# EAGLE schematic SparkFun_TensorFlow_Ambiq_Apollo3 (EAGLE 9.4.2)

## Sheet 1 of 2
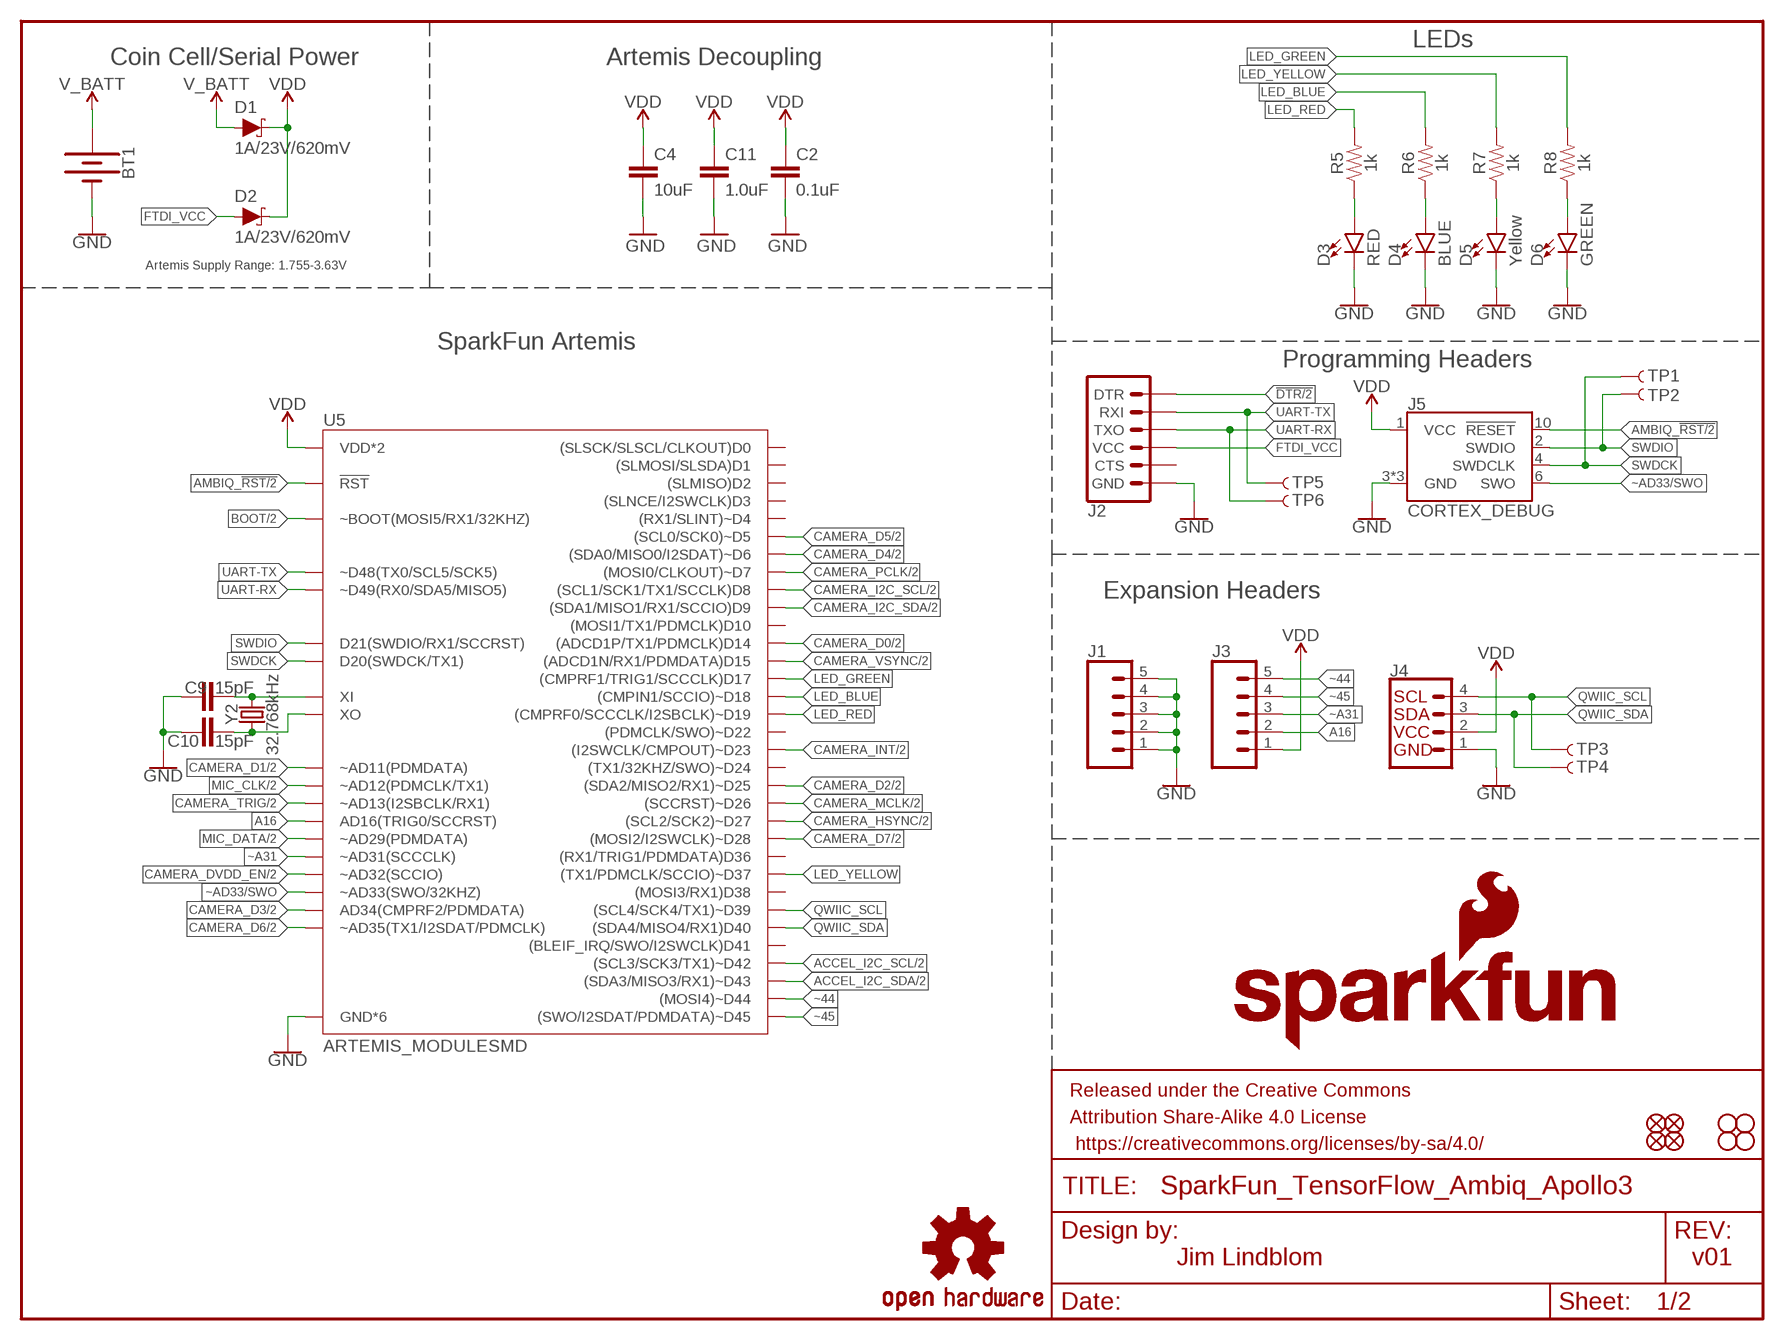
[diagram p0: schematic, sheet 1]

### Parts
BT1  BATTERY-20MM_SMD_4LEGS_OVERPASTE_INNER  [BATTCON_20MM_4LEGS_OVERPASTE_INNER]
C2  0.1uF  0.1UF-0402T-16V-10%  [0402-TIGHT]
C4  10uF  10UF-0603-6.3V-20%  [0603]
C9  15pF  15PF-0402-TIGHT-50V-5%  [0402-TIGHT]
C10  15pF  15PF-0402-TIGHT-50V-5%  [0402-TIGHT]
C11  1.0uF  1.0UF-0402T-16V-10%  [0402-TIGHT]
D1  1A/23V/620mV  DIODE-SCHOTTKY-BAT20J  [SOD-323]
D2  1A/23V/620mV  DIODE-SCHOTTKY-BAT20J  [SOD-323]
D3  RED  LED-RED0603  [LED-0603]
D4  BLUE  LED-BLUE0603  [LED-0603]
D5  Yellow  LED-YELLOW0603  [LED-0603]
D6  GREEN  LED-GREEN0603  [LED-0603]
FD1  FIDUCIAL1X2  [FIDUCIAL-1X2]
FD2  FIDUCIAL1X2  [FIDUCIAL-1X2]
FD3  FIDUCIAL1X2  [FIDUCIAL-1X2]
FD4  FIDUCIAL1X2  [FIDUCIAL-1X2]
FRAME1  FRAME-LETTER  [CREATIVE_COMMONS]
H1  STAND-OFF  [STAND-OFF]
H2  STAND-OFF  [STAND-OFF]
H3  STAND-OFF  [STAND-OFF]
H4  STAND-OFF  [STAND-OFF]
J1  CONN_05NO_SILK  [1X05_NO_SILK]
J2  6_PIN_SERIAL_TARGETSMD  [1X06-SMD_RA_MALE]
J3  CONN_05NO_SILK  [1X05_NO_SILK]
J4  QWIIC_CONNECTORJS-1MM  [JST04_1MM_RA]
J5  CORTEX_DEBUG  CORTEX_DEBUG_MINIMUM_PTH  [2X5-PTH-1.27MM]
LOGO1  SFE_LOGO_NAME_FLAME.1_INCH  [SFE_LOGO_NAME_FLAME_.1]
LOGO2  OSHW-LOGOS  [OSHW-LOGO-S]
R5  1k  1KOHM-0603-1/10W-1%  [0603]
R6  1k  1KOHM-0603-1/10W-1%  [0603]
R7  1k  1KOHM-0603-1/10W-1%  [0603]
R8  1k  1KOHM-0603-1/10W-1%  [0603]
TP1  TEST-POINT3X5  [PAD.03X.05]
TP2  TEST-POINT3X5  [PAD.03X.05]
TP3  TEST-POINT3X5  [PAD.03X.05]
TP4  TEST-POINT3X5  [PAD.03X.05]
TP5  TEST-POINT3X5  [PAD.03X.05]
TP6  TEST-POINT3X5  [PAD.03X.05]
U5  ARTEMIS_MODULESMD  [ARTEMIS_FP]
Y2  32.768kHz  CRYSTAL-32.768KHZSMD-3.2X1.5  [CRYSTAL-SMD-3.2X1.5MM]

### Nets
!DTR: J2.1(DTR) ; also sheet 2
A16: J3.2 U5.AD16(AD16(TRIG0/SCCRST))
ACCEL_I2C_SCL: U5.~D42((SCL3/SCK3/TX1)~D42) ; also sheet 2
ACCEL_I2C_SDA: U5.~D43((SDA3/MISO3/RX1)~D43) ; also sheet 2
AMBIQ_!RST: J5.10(!RESET) U5.~RST(!RST) ; also sheet 2
BOOT: U5.BOOT(~BOOT(MOSI5/RX1/32KHZ)) ; also sheet 2
CAMERA_D0: U5.D14((ADCD1P/TX1/PDMCLK)D14) ; also sheet 2
CAMERA_D1: U5.~AD11(~AD11(PDMDATA)) ; also sheet 2
CAMERA_D2: U5.~D25((SDA2/MISO2/RX1)~D25) ; also sheet 2
CAMERA_D3: U5.AD34(AD34(CMPRF2/PDMDATA)) ; also sheet 2
CAMERA_D4: U5.~D6((SDA0/MISO0/I2SDAT)~D6) ; also sheet 2
CAMERA_D5: U5.~D5((SCL0/SCK0)~D5) ; also sheet 2
CAMERA_D6: U5.~AD35(~AD35(TX1/I2SDAT/PDMCLK)) ; also sheet 2
CAMERA_D7: U5.~D28((MOSI2/I2SWCLK)~D28) ; also sheet 2
CAMERA_DVDD_EN: U5.~AD32(~AD32(SCCIO)) ; also sheet 2
CAMERA_HSYNC: U5.~D27((SCL2/SCK2)~D27) ; also sheet 2
CAMERA_I2C_SCL: U5.D8((SCL1/SCK1/TX1/SCCLK)D8) ; also sheet 2
CAMERA_I2C_SDA: U5.D9((SDA1/MISO1/RX1/SCCIO)D9) ; also sheet 2
CAMERA_INT: U5.~D23((I2SWCLK/CMPOUT)~D23) ; also sheet 2
CAMERA_MCLK: U5.~D26((SCCRST)~D26) ; also sheet 2
CAMERA_PCLK: U5.D7((MOSI0/CLKOUT)~D7) ; also sheet 2
CAMERA_TRIG: U5.~AD13(~AD13(I2SBCLK/RX1)) ; also sheet 2
CAMERA_VSYNC: U5.D15((ADCD1N/RX1/PDMDATA)D15) ; also sheet 2
FTDI_VCC: D2.A J2.4(VCC)
GND: BT1.2(-) C2.1 C4.2 C9.1 C10.1 C11.2 D3.C D4.C D5.C D6.C J1.1 J1.2 J1.3 J1.4 J1.5 J2.6(GND) J4.1 J5.3(GND) J5.5(GND) J5.9(GND) U5.GND@1(GND*6) U5.GND@22(GND*6) U5.GND@38(GND*6) U5.GND@39(GND*6) U5.GND@47(GND*6) U5.GND@59(GND*6) ; also sheet 2
LED_BLUE: R6.2 U5.~D18((CMPIN1/SCCIO)~D18)
LED_GREEN: R8.2 U5.D17((CMPRF1/TRIG1/SCCCLK)D17)
LED_RED: R5.2 U5.~D19((CMPRF0/SCCCLK/I2SBCLK)~D19)
LED_YELLOW: R7.2 U5.~D37((TX1/PDMCLK/SCCIO)~D37)
MIC_CLK: U5.~AD12(~AD12(PDMCLK/TX1)) ; also sheet 2
MIC_DATA: U5.~AD29(~AD29(PDMDATA)) ; also sheet 2
N$2: C9.2 U5.XI Y2.P$2
N$5: D4.A R6.1
N$6: D3.A R5.1
N$7: D5.A R7.1
N$8: D6.A R8.1
QWIIC_SCL: J4.4 TP3.P$1 U5.~D39((SCL4/SCK4/TX1)~D39)
QWIIC_SDA: J4.3 TP4.P$1 U5.D40((SDA4/MISO4/RX1)D40)
SWDCK: J5.4(SWDCLK) TP1.P$1 U5.SWDCK(D20(SWDCK/TX1))
SWDIO: J5.2(SWDIO) TP2.P$1 U5.SWDIO(D21(SWDIO/RX1/SCCRST))
UART-RX: J2.3(TXO) TP6.P$1 U5.RXI-0(~D49(RX0/SDA5/MISO5))
UART-TX: J2.2(RXI) TP5.P$1 U5.TXO-0(~D48(TX0/SCL5/SCK5))
V_BATT: BT1.1(+) D1.A
VDD: C2.2 C4.1 C11.1 D1.C D2.C J3.1 J4.2 J5.1(VCC) U5.VDD@36(VDD*2) U5.VDD@37(VDD*2) ; also sheet 2
X0: C10.2 U5.XO Y2.P$1
~44: J3.5 U5.~D44((MOSI4)~D44)
~45: J3.4 U5.~D45((SWO/I2SDAT/PDMDATA)~D45)
~A31: J3.3 U5.~AD31(~AD31(SCCCLK))
~AD33/SWO: J5.6(SWO) U5.~AD33/SWO(~AD33(SWO/32KHZ))
Unconnected: J2.5(CTS) U5.D0((SLSCK/SLSCL/CLKOUT)D0) U5.D1((SLMOSI/SLSDA)D1) U5.D2((SLMISO)D2) U5.D3((SLNCE/I2SWCLK)D3) U5.D10((MOSI1/TX1/PDMCLK)D10) U5.D36((RX1/TRIG1/PDMDATA)D36) U5.D38((MOSI3/RX1)D38) U5.D41((BLEIF_IRQ/SWO/I2SWCLK)D41) U5.~D4((RX1/SLINT)~D4) U5.~D22((PDMCLK/SWO)~D22) U5.~D24((TX1/32KHZ/SWO)~D24)

### Notes on the sheet
- LEDs
- Coin Cell/Serial Power | Artemis Decoupling
- Artemis Supply Range: 1.755-3.63V
- SparkFun Artemis
- Programming Headers
- Expansion Headers
- Jim Lindblom | v01

## Sheet 2 of 2
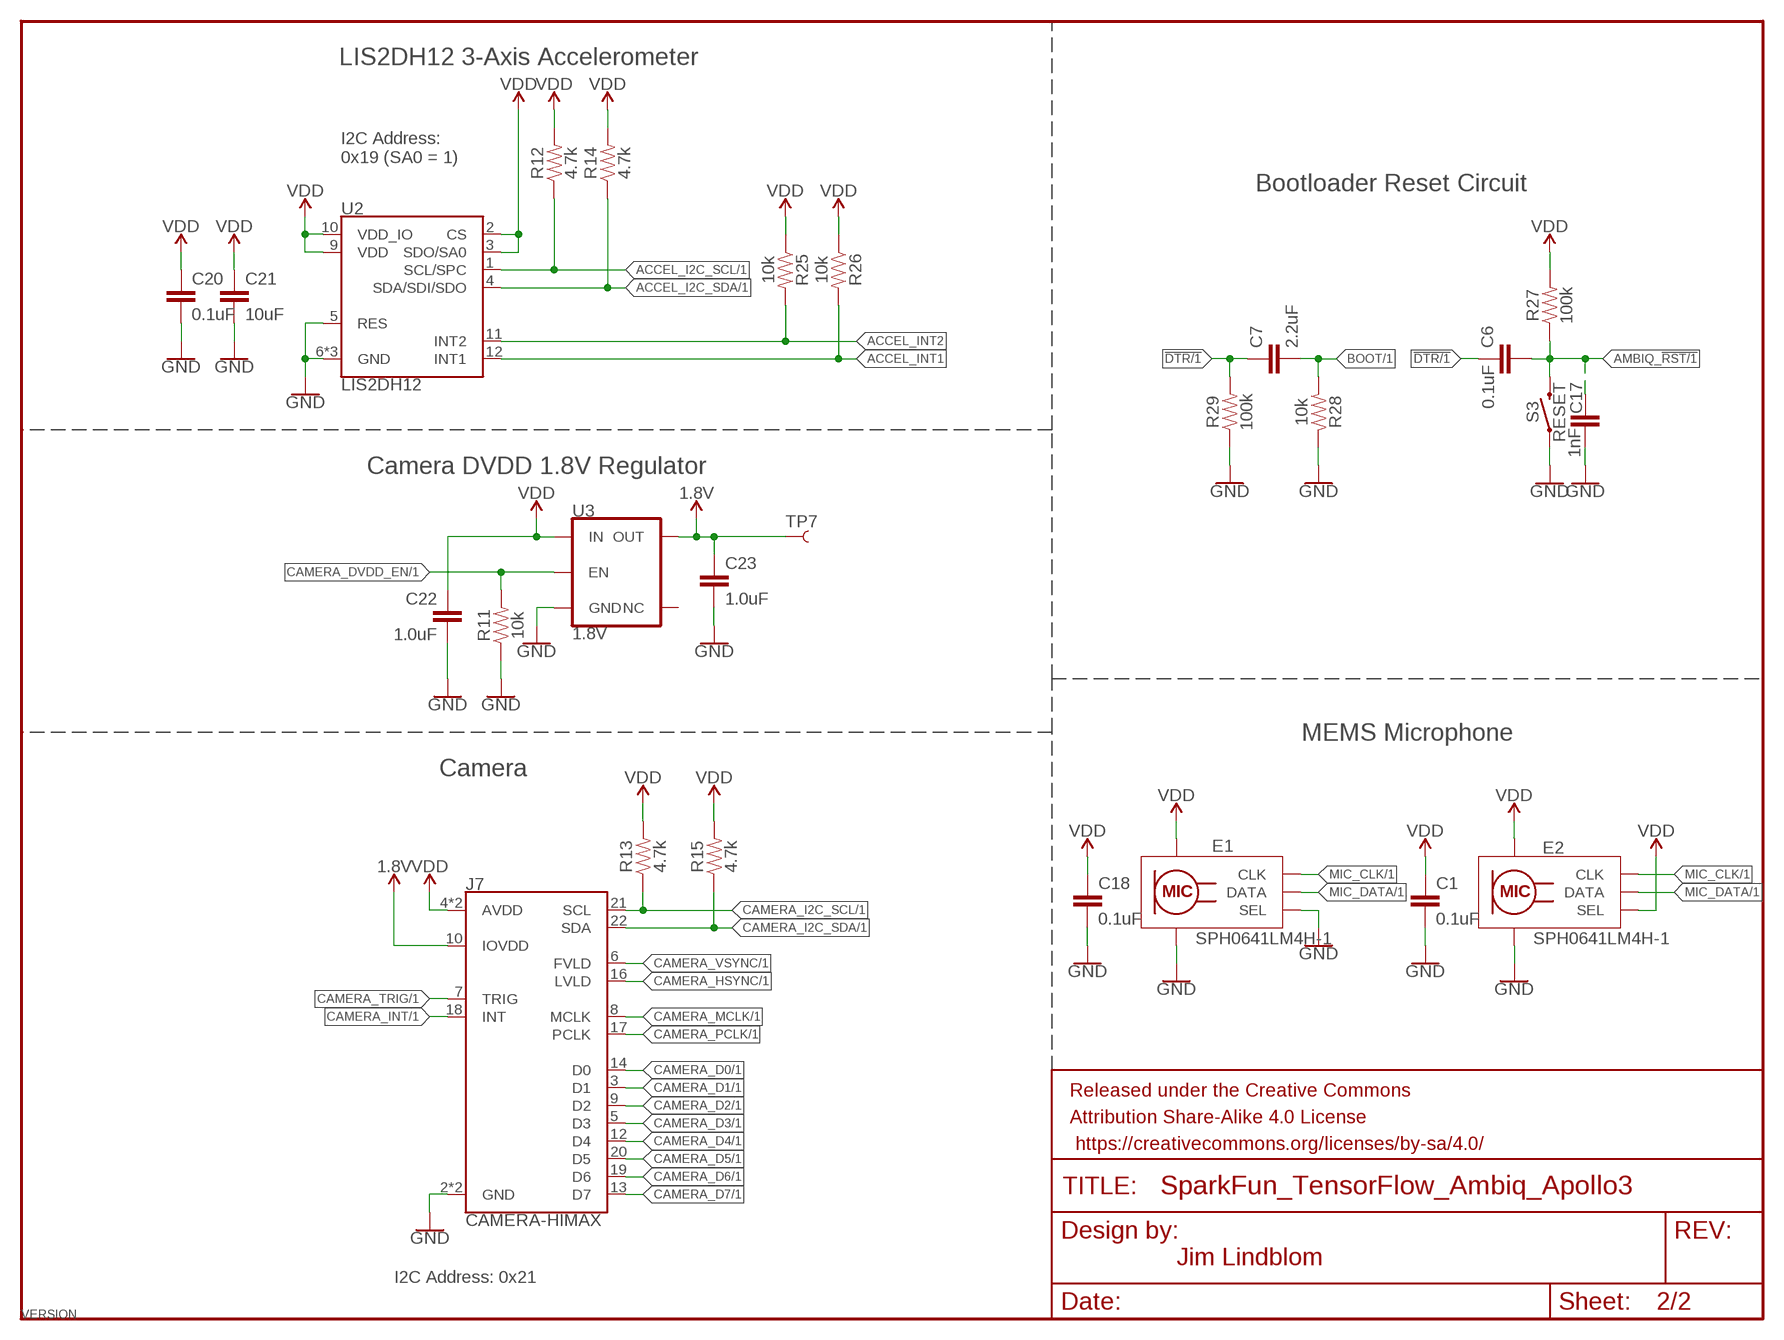
[diagram p1: schematic, sheet 2]

### Parts
C1  0.1uF  0.1UF-0402-TIGHT-16V-10%  [0402-TIGHT]
C6  0.1uF  0.1UF-0603-25V-5%  [0603]
C7  2.2uF  2.2UF-0603-10V-20%  [0603]
C17  1nF  1.0NF/1000PF-0603-50V-10%  [0603]
C18  0.1uF  0.1UF-0402-TIGHT-16V-10%  [0402-TIGHT]
C20  0.1uF  0.1UF-0402-TIGHT-16V-10%  [0402-TIGHT]
C21  10uF  10UF-0603-6.3V-20%  [0603]
C22  1.0uF  1.0UF-0402-TIGHT-16V-10%  [0402-TIGHT]
C23  1.0uF  1.0UF-0402-TIGHT-16V-10%  [0402-TIGHT]
E1  SPH0641LM4H-1  SPH0641LM4H-1_MICROPHONE  [SPH0641LM4H-1_MICROPHONE]
E2  SPH0641LM4H-1  SPH0641LM4H-1_MICROPHONE  [SPH0641LM4H-1_MICROPHONE]
FRAME2  FRAME-LETTERNO_PACKAGE  [DUMMY]
J7  CAMERA-HIMAX  [FPC-24-AMPHENOL-SFV24R-1STE1HLF]
R11  10k  10KOHM-0402T-1/16W-1%  [0402-TIGHT]
R12  4.7k  4.7KOHM-0603-1/10W-1%  [0603]
R13  4.7k  4.7KOHM-0603-1/10W-1%  [0603]
R14  4.7k  4.7KOHM-0603-1/10W-1%  [0603]
R15  4.7k  4.7KOHM-0603-1/10W-1%  [0603]
R25  10k  10KOHM-0402T-1/16W-1%  [0402-TIGHT]
R26  10k  10KOHM-0402T-1/16W-1%  [0402-TIGHT]
R27  100k  100KOHM-0603-1/10W-1%  [0603]
R28  10k  10KOHM-0603-1/10W-1%  [0603]
R29  100k  100KOHM-0603-1/10W-1%  [0603]
S3  RESET  MOMENTARY-SWITCH-SPST-SMD-4.6X2.8MM  [TACTILE_SWITCH_SMD_4.6X2.8MM]
TP7  TEST-POINT3X5  [PAD.03X.05]
U2  LIS2DH12  [LGA-12-LISDH12]
U3  1.8V  V_REG_AP2127K-1.8V  [SOT23-5]

### Nets
1.8V: C23.1 J7.10(IOVDD) TP7.P$1 U3.5(OUT)
!DTR: C6.1 C7.1 R29.2 ; also sheet 1
ACCEL_I2C_SCL: R12.1 U2.1(SCL/SPC) ; also sheet 1
ACCEL_I2C_SDA: R14.1 U2.4(SDA/SDI/SDO) ; also sheet 1
ACCEL_INT1: R26.2 U2.12(INT1)
ACCEL_INT2: R25.2 U2.11(INT2)
AMBIQ_!RST: C6.2 C17.1 R27.1 S3.3 S3.4 ; also sheet 1
BOOT: C7.2 R28.2 ; also sheet 1
CAMERA_D0: J7.14(D0) ; also sheet 1
CAMERA_D1: J7.3(D1) ; also sheet 1
CAMERA_D2: J7.9(D2) ; also sheet 1
CAMERA_D3: J7.5(D3) ; also sheet 1
CAMERA_D4: J7.12(D4) ; also sheet 1
CAMERA_D5: J7.20(D5) ; also sheet 1
CAMERA_D6: J7.19(D6) ; also sheet 1
CAMERA_D7: J7.13(D7) ; also sheet 1
CAMERA_DVDD_EN: R11.2 U3.3(EN) ; also sheet 1
CAMERA_HSYNC: J7.16(LVLD) ; also sheet 1
CAMERA_I2C_SCL: J7.21(SCL) R13.1 ; also sheet 1
CAMERA_I2C_SDA: J7.22(SDA) R15.1 ; also sheet 1
CAMERA_INT: J7.18(INT) ; also sheet 1
CAMERA_MCLK: J7.8(MCLK) ; also sheet 1
CAMERA_PCLK: J7.17(PCLK) ; also sheet 1
CAMERA_TRIG: J7.7(TRIG) ; also sheet 1
CAMERA_VSYNC: J7.6(FVLD) ; also sheet 1
GND: C1.2 C17.2 C18.2 C20.2 C21.2 C22.2 C23.2 E1.2(SEL) E1.3(GND) E1.6(GND) E1.7(GND) E1.8(GND) E2.3(GND) E2.6(GND) E2.7(GND) E2.8(GND) J7.2(GND) J7.15(GND) R11.1 R28.1 R29.1 S3.1 S3.2 U2.5(RES) U2.6(GND) U2.7(GND) U2.8(GND) U3.2(GND) ; also sheet 1
MIC_CLK: E1.4(CLK) E2.4(CLK) ; also sheet 1
MIC_DATA: E1.1(DATA) E2.1(DATA) ; also sheet 1
VDD: C1.1 C18.1 C20.1 C21.1 C22.1 E1.5(VDD) E2.2(SEL) E2.5(VDD) J7.4(AVDD) J7.11(AVDD) R12.2 R13.2 R14.2 R15.2 R25.1 R26.1 R27.2 U2.2(CS) U2.3(SDO/SA0) U2.9(VDD) U2.10(VDD_IO) U3.1(IN) ; also sheet 1
Unconnected: J7.MNT1@0(MNT1) J7.MNT1@1(MNT1) J7.MNT2@0(MNT2) J7.MNT2@1(MNT2) U3.4(NC)

### Notes on the sheet
- LIS2DH12 3-Axis Accelerometer
- I2C Address:
  0x19 (SA0 = 1)
- Bootloader Reset Circuit
- Camera DVDD 1.8V Regulator
- MEMS Microphone
- Camera
- Jim Lindblom
- I2C Address: 0x21

## Library data of the parts
BT1 = SparkFun-Batteries:BATTERY: Battery - Single Cell A variety of battery chemistries, sizes, and footprints. Device List: 20MM_PTH - Coin Cell Battery Holder - 20mm (PTH) <https://www.sparkfun.com/products/783> 20MM_PTH_KIT- Coin Cell battery Holder - 20 mm (PTH) <http://www.sparkfun.com/products/783>kit version with special mask 6.8MM_PTH - Coin Cell Battery Holder - 6.8MM(SMD) <https://www.digikey.com/product-detail/en/seiko-instruments/MS621FE-FL11E/728-1057-ND/1889208?WT.srch=1&gclid=CNOQ5a6LzdQCFZS2wAodXCkE0g> 12MM_SMD - Coin Cell Battery Holder - 12mm (SMD) <https://www.sparkfun.com/products/10592> 12MM_PTH - Coin Cell Battery Holder - 12mm (PTH) <https://www.sparkfun.com/products/7948> 20MM_SMD - 20mm Coin Cell Battery Holder (SMD) (2 legs) Used on the Big Time Watch Kit <https://www.sparkfun.com/products/11734> 20MM_SMD_4LEGS - Coin Cell Battery Holder - 20mm (SMD) <https://www.sparkfun.com/products/11892> 20MM_SMD_4LEGS_OVERPASTE - Coin Cell Battery Holder - 20mm (SMD) <https://www.sparkfun.com/products/11892> (Over-paste on the legs) 24.5MM_PTH - Coin Cell Battery Holder - 24.5mm (PTH) <https://www.sparkfun.com/products/8863> 9V - 9V Battery Holder - PC Mount Used on the SparkFun SparkPunk Sound Kit <https://www.sparkfun.com/products/11177> and SparkFun SparkPunk Sequencer Kit <https://www.sparkfun.com/products/12707> 18650 - Battery Holder - 18650 (PTH) <https://www.sparkfun.com/products/13113> AA - Battery Holder - 1xAA (PTH) <https://www.sparkfun.com/products/7949> AAA - Battery Holder - 1xAAA (PTH) <https://www.sparkfun.com/products/12718> AA_KIT - Battery Holder - 1xAA (PTH) <https://www.sparkfun.com/products/7949> Special kit package - pads only have exposed copper on one side of the board. AAA_KIT - Battery Holder - 1xAAA (PTH) <https://www.sparkfun.com/products/12718> Special kit package - pads only have exposed copper on one side of the board.
C1 C18 C20 = ambiq:0.1UF: 0.1µF ceramic capacitors A capacitor is a passive two-terminal electrical component used to store electrical energy temporarily in an electric field.; PROD_ID: CAP-12416
C2 = SparkFun-Capacitors:0.1UF: 0.1µF ceramic capacitors A capacitor is a passive two-terminal electrical component used to store electrical energy temporarily in an electric field.; PROD_ID: CAP-12416
C4 C21 = SparkFun-Capacitors:10UF: 10.0µF ceramic capacitors A capacitor is a passive two-terminal electrical component used to store electrical energy temporarily in an electric field.; PROD_ID: CAP-11015
C6 = SparkFun-Capacitors:0.1UF: 0.1µF ceramic capacitors A capacitor is a passive two-terminal electrical component used to store electrical energy temporarily in an electric field.; PROD_ID: CAP-08604
C7 = SparkFun-Capacitors:2.2UF: 2.2µF ceramic capacitors A capacitor is a passive two-terminal electrical component used to store electrical energy temporarily in an electric field.; PROD_ID: CAP-07888
C9 C10 = ambiq:15PF: 15pF ceramic capacitors A capacitor is a passive two-terminal electrical component used to store electrical energy temporarily in an electric field.; PROD_ID: CAP-13063
C11 = SparkFun-Capacitors:1.0UF: 1µF ceramic capacitors A capacitor is a passive two-terminal electrical component used to store electrical energy temporarily in an electric field.; PROD_ID: CAP-12417
C17 = SparkFun-Capacitors:1.0NF/1000PF: 1nF/1,000pF ceramic capacitors A capacitor is a passive two-terminal electrical component used to store electrical energy temporarily in an electric field.; PROD_ID: CAP-07886
C22 C23 = ambiq:1.0UF: 1µF ceramic capacitors A capacitor is a passive two-terminal electrical component used to store electrical energy temporarily in an electric field.; PROD_ID: CAP-12417
D1 D2 = SparkFun-DiscreteSemi:DIODE-SCHOTTKY: Schottky diode A Schottky diode is a semiconductor diode which has a low forward voltage drop and a very fast switching action.; PROD_ID: DIO-11623
D3 = SparkFun-LED:LED-RED: Red SMD LED Used in manufacturing of most products at SparkFun Packages: 0603 - SMD 0603 package [Product Link] <http://docs.avagotech.com/docs/AV02-0551EN> 0603 SMART - SMD 0603 SMART package ( more efficient and expensive)[Product Link] <http://www.osram-os.com/Graphics/XPic2/00077099_0.pdf> 1206 - SMD1206 package [Product Link] <https://www.sparkfun.com/datasheets/DevTools/LilyPad/Q150OVS4.pdff> SparkFun Products: Pro Mini 328 -5V <https://www.sparkfun.com/products/821> RedBoard <https://www.sparkfun.com/products/12757> IOIO-OTG <https://www.sparkfun.com/products/13613>; PROD_ID: DIO-00819
D4 = SparkFun-LED:LED-BLUE: Blue SMD LED Used in manufacturing of various products at SparkFun Packages: 0603 - SMD 0603 package [Product Link] <http://www.digikey.com/product-detail/en/SMLE12BC7TT86/511-1589-2-ND/1641808> 1206 - SMD1206 package [Product Link] <http://www.digikey.com/product-detail/en/lite-on-inc/LTST-C150TBKT/160-1643-1-ND/573584> SparkFun Products: ESP8266 Thing-Dev Board <https://www.sparkfun.com/products/13711> RedBoard <https://www.sparkfun.com/products/12757>; PROD_ID: DIO-08575
D5 = SparkFun-LED:LED-YELLOW: Yellow SMD LED Used in manufacturing several products at SparkFun. Packages: 0603 - SMD 0603 package[Product Link] <http://www.kingbrightusa.com/product.asp?catalog_name=LED&product_id=APT1608SYCK> 0603 -SMART - SMART SMD 0603 package (more efficient/more expensive) [Product Link] <http://www.osram-os.com/osram_os/en/products/product-catalog/led-light-emitting-diodes/smartled-0603/ly-l29k/index.jsp> LilyPad - SMD1206 package[Product Datasheet] <https://www.sparkfun.com/datasheets/DevTools/LilyPad/Q150YUS4.pdf> SparkFun Products: Blynk Board <https://www.sparkfun.com/products/13794> IOIO-OTG <https://www.sparkfun.com/products/13613> XBee Explorer Serial <https://www.sparkfun.com/products/13225>; PROD_ID: DIO-09003
D6 = SparkFun-LED:LED-GREEN: Green SMD LED Used in manufacturing of various products at SparkFun Packages: 0603 - SMD 0603 package [Product Link] <http://www.futureelectronics.com/en/technologies/semiconductors/optoelectronics/leds/Pages/9894312-LTST-C190GKT.aspx?CrossPart=HSMG-C190&IM=0> LilyPad 1206 - SMD1206 LilyPad package [Product Link] <http://www.futureelectronics.com/en/Technologies/Product.aspx?ProductID=IN150NGHARVATEKCORPORATION2049943&IM=0> 1206 - SMD1206 package [Product Link] <http://www.futureelectronics.com/en/technologies/semiconductors/optoelectronics/leds/Pages/8315665-LTST-C150KGKT.aspx?IM=0> 1206 Bottom Mount -SMD 1206 Bottom Mount [Product Link] <http://www.digikey.com/product-detail/en/lite-on-inc/LTST-C230KGKT/160-1456-1-ND/386854> SparkFun Products: Pro Mini 328 -5V <https://www.sparkfun.com/products/821> RedBoard <https://www.sparkfun.com/products/12757> MP3 Trigger <https://www.sparkfun.com/products/13720> Makey Makey <https://www.sparkfun.com/products/11076>; PROD_ID: DIO-00821
E1 E2 = SparkFun-Sensors:SPH0641LM4H-1_MICROPHONE: SPH0641LM4H-1 Microphone A miniature, high-performance, low power, bottom port silicon digital microphone with a single bit PDM output.; PROD_ID: IC-14361
FD1-FD4 = SparkFun-Aesthetics:FIDUCIAL: Fiducial Alignment Points Point-of-reference for pick-and-place machines and other optical instruments.
FRAME1 = SparkFun-Aesthetics:FRAME-LETTER: Schematic Frame - Letter Standard 8.5x11 US Letter frame
FRAME2 = SparkFun-Aesthetics:FRAME-LETTER: Schematic Frame - Letter Standard 8.5x11 US Letter frame; DESIGNER: Nobody; VERSION: x01
H1-H4 = SparkFun-Hardware:STAND-OFF: Stand Off Drill holes for mechanically mounting via screws, standoffs, etc. Note: Use the keepout ring to avoid running the screw head into surrounding components. Variant Overviews STAND-OFF - Mechanical footprint for a #4 phillips button head screw. STAND-OFF-TIGHT - Mechanical footprint for a #4 phillips button head screw, Example SparkFun Products Screw - Phillips Head (1/4", 4-40, 10 pack) <https://www.sparkfun.com/products/10453> (PRT-10453) Screw - Phillips Head (1/2", 4-40, 10 pack) <https://www.sparkfun.com/products/10452> (PRT-10452) Screw - Phillips Head (3/4", 4-40, 10 pack) <https://www.sparkfun.com/products/10451> (PRT-10451) Screw - Phillips Head (1", 4-40, 10 pack) <https://www.sparkfun.com/products/10450> (PRT-10450)
J1 J3 = SparkFun-Connectors:CONN_05: Multi connection point. Often used as Generic Header-pin footprint for 0.1 inch spaced/style header connections On any of the 0.1 inch spaced packages, you can populate with these: Break Away Headers - Straight <https://www.sparkfun.com/products/116> (PRT-00116) Break Away Male Headers - Right Angle <https://www.sparkfun.com/products/553> (PRT-00553) Female Headers <https://www.sparkfun.com/products/115> (PRT-00115) Break Away Headers - Machine Pin <https://www.sparkfun.com/products/117> (PRT-00117) Break Away Female Headers - Swiss Machine Pin <https://www.sparkfun.com/products/743> (PRT-00743) For SCREWTERMINALS and SPRING TERMINALS visit here: Screw Terimnals on SparkFun.com <https://www.sparkfun.com/search/results?term=Screw+Terminals> (5mm/3.5mm/2.54mm spacing) This device is also useful as a general connection point to wire up your design to another part of your project. Our various solder wires solder well into these plated through hole pads. Hook-Up Wire - Assortment (Stranded, 22 AWG) <https://www.sparkfun.com/products/11375> (PRT-11375) Hook-Up Wire - Assortment (Solid Core, 22 AWG) <https://www.sparkfun.com/products/11367> (PRT-11367) View the entire wire category on our website here <https://www.sparkfun.com/categories/141> Special notes: Molex polarized connector foot print use with SKU : PRT-08231 with associated crimp pins and housings. 1MM SMD Version SKU: PRT-10208
J2 = SparkFun-Connectors:6_PIN_SERIAL_TARGET: 6-pin header connection for use with the "FTDI BASIC" pinout - TARGET SIDE. Also known as "Arduino Serial Program Header". It is used to mate with our FTDI Basic serial programmers using the Arduino IDE. Note, this device has "TARGET" in the name. It is intended to be used on a design that contains a target micro-controller that you wish to program. The "sister" device, named "CABLE" is inteneded to be used on a design that usually lives on the end of your USB cable and prvides the converter chip (FTDI232 or FTDI231x) to commnicate serial RX/TX. You can populate with some of these: Break Away Headers - Straight <https://www.sparkfun.com/products/116> (PRT-00116) For reference (or to suit your programming needs) check out these designs: SparkFun FTDI Basic Breakout - 5V <https://www.sparkfun.com/products/9716> (DEV-09716) SparkFun FTDI Basic Breakout - 3.3V <https://www.sparkfun.com/products/9873> (DEV-09873) SparkFun FTDI SmartBasic <https://www.sparkfun.com/products/12935> (DEV-12935) SparkFun Beefy 3 - FTDI Basic Breakout <https://www.sparkfun.com/products/13746> (DEV-13746); PROD_ID: CONN-08971
J4 = SparkFun-Connectors:QWIIC_CONNECTOR: SparkFun I2C Standard Qwiic Connector An SMD 1mm pitch JST connector makes it easy and quick (get it? Qwiic?) to connect I2C devices to each other. The Qwiic system <http://www.sparkfun.com/qwiic> enables fast and solderless connection between popular platforms and various sensors and actuators. We carry 200mm <https://www.sparkfun.com/products/14204>, 100mm <https://www.sparkfun.com/products/14205>, 50mm <https://www.sparkfun.com/products/14206>, and breadboard friendly <https://www.sparkfun.com/products/14207> Qwiic cables. We also offer 10 pcs strips <https://www.sparkfun.com/products/14323> the SMD connectors.; PROD_ID: CONN-13694
J5 = SparkFun-Connectors:CORTEX_DEBUG_MINIMUM: Cortex Debug Connector - 10 pin Supports JTAG debug, Serial Wire debug, and Serial Wire Viewer. PTH and SMD connector options available. General Connector Information <http://infocenter.arm.com/help/topic/com.arm.doc.faqs/attached/13634/cortex_debug_connectors.pdf> Products: PTH Connector <http://www.digikey.com/product-detail/en/cnc-tech/3220-10-0100-00/1175-1627-ND/3883661> -via Digi-Key SparkFun PSoc <https://www.sparkfun.com/products/13229> SparkFun T <https://www.sparkfun.com/products/13810>
J7 = SparkFun-Connectors:CAMERA-HIMAX; DIGIKEY: 609-4320-2-ND; PROD_ID: CONN-14233
LOGO1 = SparkFun-Aesthetics:SFE_LOGO_NAME_FLAME: SparkFun Font Logo w/ Flame This is the SparkFun full logo. The logo on the schematic will always be the same size; the package variant is the height of the flame part of the logo. Default layer for the logo on the board is tSilk.
LOGO2 = SparkFun-Aesthetics:OSHW-LOGO: Open-Source Hardware (OSHW) Logo This logo indicates the piece of hardware it is found on incorporates a OSHW license and/or adheres to the definition of open source hardware found here: http://freedomdefined.org/OSHW
R5-R8 = SparkFun-Resistors:1KOHM: 1kΩ resistor A resistor is a passive two-terminal electrical component that implements electrical resistance as a circuit element. Resistors act to reduce current flow, and, at the same time, act to lower voltage levels within circuits. - Wikipedia; PROD_ID: RES-07856
R11 R25 R26 = SparkFun-Resistors:10KOHM: 10kΩ resistor A resistor is a passive two-terminal electrical component that implements electrical resistance as a circuit element. Resistors act to reduce current flow, and, at the same time, act to lower voltage levels within circuits. - Wikipedia; PROD_ID: RES-14241
R12-R15 = SparkFun-Resistors:4.7KOHM: 4.7kΩ resistor A resistor is a passive two-terminal electrical component that implements electrical resistance as a circuit element. Resistors act to reduce current flow, and, at the same time, act to lower voltage levels within circuits. - Wikipedia; PROD_ID: RES-07857
R27 R29 = SparkFun-Resistors:100KOHM: 100kΩ resistor A resistor is a passive two-terminal electrical component that implements electrical resistance as a circuit element. Resistors act to reduce current flow, and, at the same time, act to lower voltage levels within circuits. - Wikipedia; PROD_ID: RES-07828
R28 = SparkFun-Resistors:10KOHM: 10kΩ resistor A resistor is a passive two-terminal electrical component that implements electrical resistance as a circuit element. Resistors act to reduce current flow, and, at the same time, act to lower voltage levels within circuits. - Wikipedia; PROD_ID: RES-00824
S3 = SparkFun-Switches:MOMENTARY-SWITCH-SPST: Momentary Switch (Pushbutton) - SPST Normally-open (NO) SPST momentary switches (buttons, pushbuttons). Variants PTH-12MM - 12mm square, through-hole Momentary Pushbutton Switch - 12mm Square <https://www.sparkfun.com/products/9190> (COM-09190) PTH-6.0MM, PTH-6.0MM-KIT - 6.0mm square, through-hole Mini Pushbutton Switch <https://www.sparkfun.com/products/97> (COM-00097) KIT package intended for soldering kit's - only one side of pads' copper is exposed. PTH-RIGHT-ANGLE-KIT - Right-angle, through-hole Right Angle Tactile Button <https://www.sparkfun.com/products/10791> - Used on SparkFun BigTime Watch Kit <https://www.sparkfun.com/products/11734> SMD-12MM - 12mm square, surface-mount Tactile Button - SMD (12mm) <https://www.sparkfun.com/products/12993> (COM-12993) Used on SparkFun PicoBoard <https://www.sparkfun.com/products/11888> SMD-4.5MM - 4.5mm Square Trackball Switch Used on SparkFun Blackberry Trackballer Breakout <https://www.sparkfun.com/products/13169> SMD-4.6MMX2.8MM - 4.60mm x 2.80mm, surface mount Used on SparkFun SAMD21 Mini Breakout <https://www.sparkfun.com/products/13664> SMD-5.2MM, SMD-5.2-REDUNDANT - 5.2mm square, surface-mount Mini Pushbutton Switch - SMD <https://www.sparkfun.com/products/8720> (COM-08720) Used on Arduino Pro Mini <https://www.sparkfun.com/products/11114> REDUNDANT package connects both switch circuits together SMD-6.0X3.5MM - 6.0 x 3.5mm, surface mount Momentary Reset Switch SMD <https://www.sparkfun.com/products/8229> (COM-08229) SMD-6.2MM-TALL - 6.2mm square, surface mount Tactile Button - SMD (6mm) <https://www.sparkfun.com/products/12992> Used on SparkFun Digital Sandbox <https://www.sparkfun.com/products/12651> SMD-RIGHT-ANGLE - Right-angle, surface mount Used on SparkFun Block for Intel® Edison - Arduino <https://www.sparkfun.com/products/13036>; PROD_ID: SWCH-13065
TP1-TP7 = SparkFun-Connectors:TEST-POINT: SparkFun Test Points Bare copper test points for troubleshooting or In-Circuit-Testing. These are used by our Production team for verifying production board runs using pogo-pins on test beds. SparkFun Products: SparkFun LSM9DS1 Breakout <https://www.sparkfun.com/products/13284> SparkFun PSOC <https://www.sparkfun.com/products/13714> SparkFun Load Cell Amplifier <https://www.sparkfun.com/products/13879>
U2 = SparkFun-Sensors:LIS2DH12; DIGIKEY: 497-14851-2-ND; PROD_ID: IC-14229
U3 = SparkFun-IC-Power:V_REG_AP2127: AP2127 - 300mA CMOS LDO Regulator w/ Enable The AP2127 is CMOS process low dropout linear regulator with enable function, the regulator delivers a guaranteed 300mA (min.) continuous load current. Features Output Voltage Accuracy: ±1.5% Output Current: 300mA (Min.) Foldback Short Current Protection: 50mA Enable Function to Turn ON/OFF VOUT Low Dropout Voltage (3.3V): 250mV (Typ.) @IOUT=600mA Excellent Load Regulation: 0.2%/A (Typ.) Excellent Line Regulation: 0.02%/V (Typ.) Low Quiescent Current: 55μA (Typ.) Low Standby Current: 0.01μA (Typ.) Low Output Noise: 50μVRMS PSRR: 100Hz -65dB, 1kHz -65dB OTSD Protection Stable with 1.0μF Flexible Cap: Ceramic, Tantalum and Aluminum Electrolytic Operation Temperature Range: -40°C to 85°C ESD: MM 400V, HBM 4000V; PROD_ID: VREG-14239
U5 = SparkFun-IC-Microcontroller:ARTEMIS_MODULE: Description: The Artemis Module from SparkFun is a Cortex-M4F with BLE 5.0 running up to 96MHz and with as low power as 6uA per MHz (less than 5mW). This is the world's first module to bridge the market between hobbyists and consumer products. We've packaged all the power of a modern microcontroller into a module that is both extremely easy to use but is mass-market ready. The flexibility of the Artemis module starts with our [Arduino core](https://github.com/sparkfun/Arduino_Apollo3). You can program and use the Artemis module just like you would an Uno or any other Arduino. Time to first blink is just 5 minutes away! We built the core from the ground up, making it fast and as light weight as possible.; PROD_ID: SUB-14415
Y2 = SparkFun-Clocks:CRYSTAL-32.768KHZ: 32.768kHz Crystal Frequency: 32.768kHz Frequency Stability: ±20ppm Load Capacitance: 12.5pF (PTH-2X6 & SMD-3.2X1.5), 6pF (SMD-2X6) SparkFun Products: SparkFun BigTime Watch Kit <https://www.sparkfun.com/products/11734> SparkFun nRF52832 Breakout <https://www.sparkfun.com/products/13990> SparkFun Real Time Clock Module <https://www.sparkfun.com/products/12708>; PROD_ID: XTAL-13062

## Net classes
0 default: width 0 mm, drill 0 mm
2 usb: width 0.254 mm, drill 0.305 mm, clearance 0.254 mm